# EAGLE design MiniBee (EAGLE 5.05)
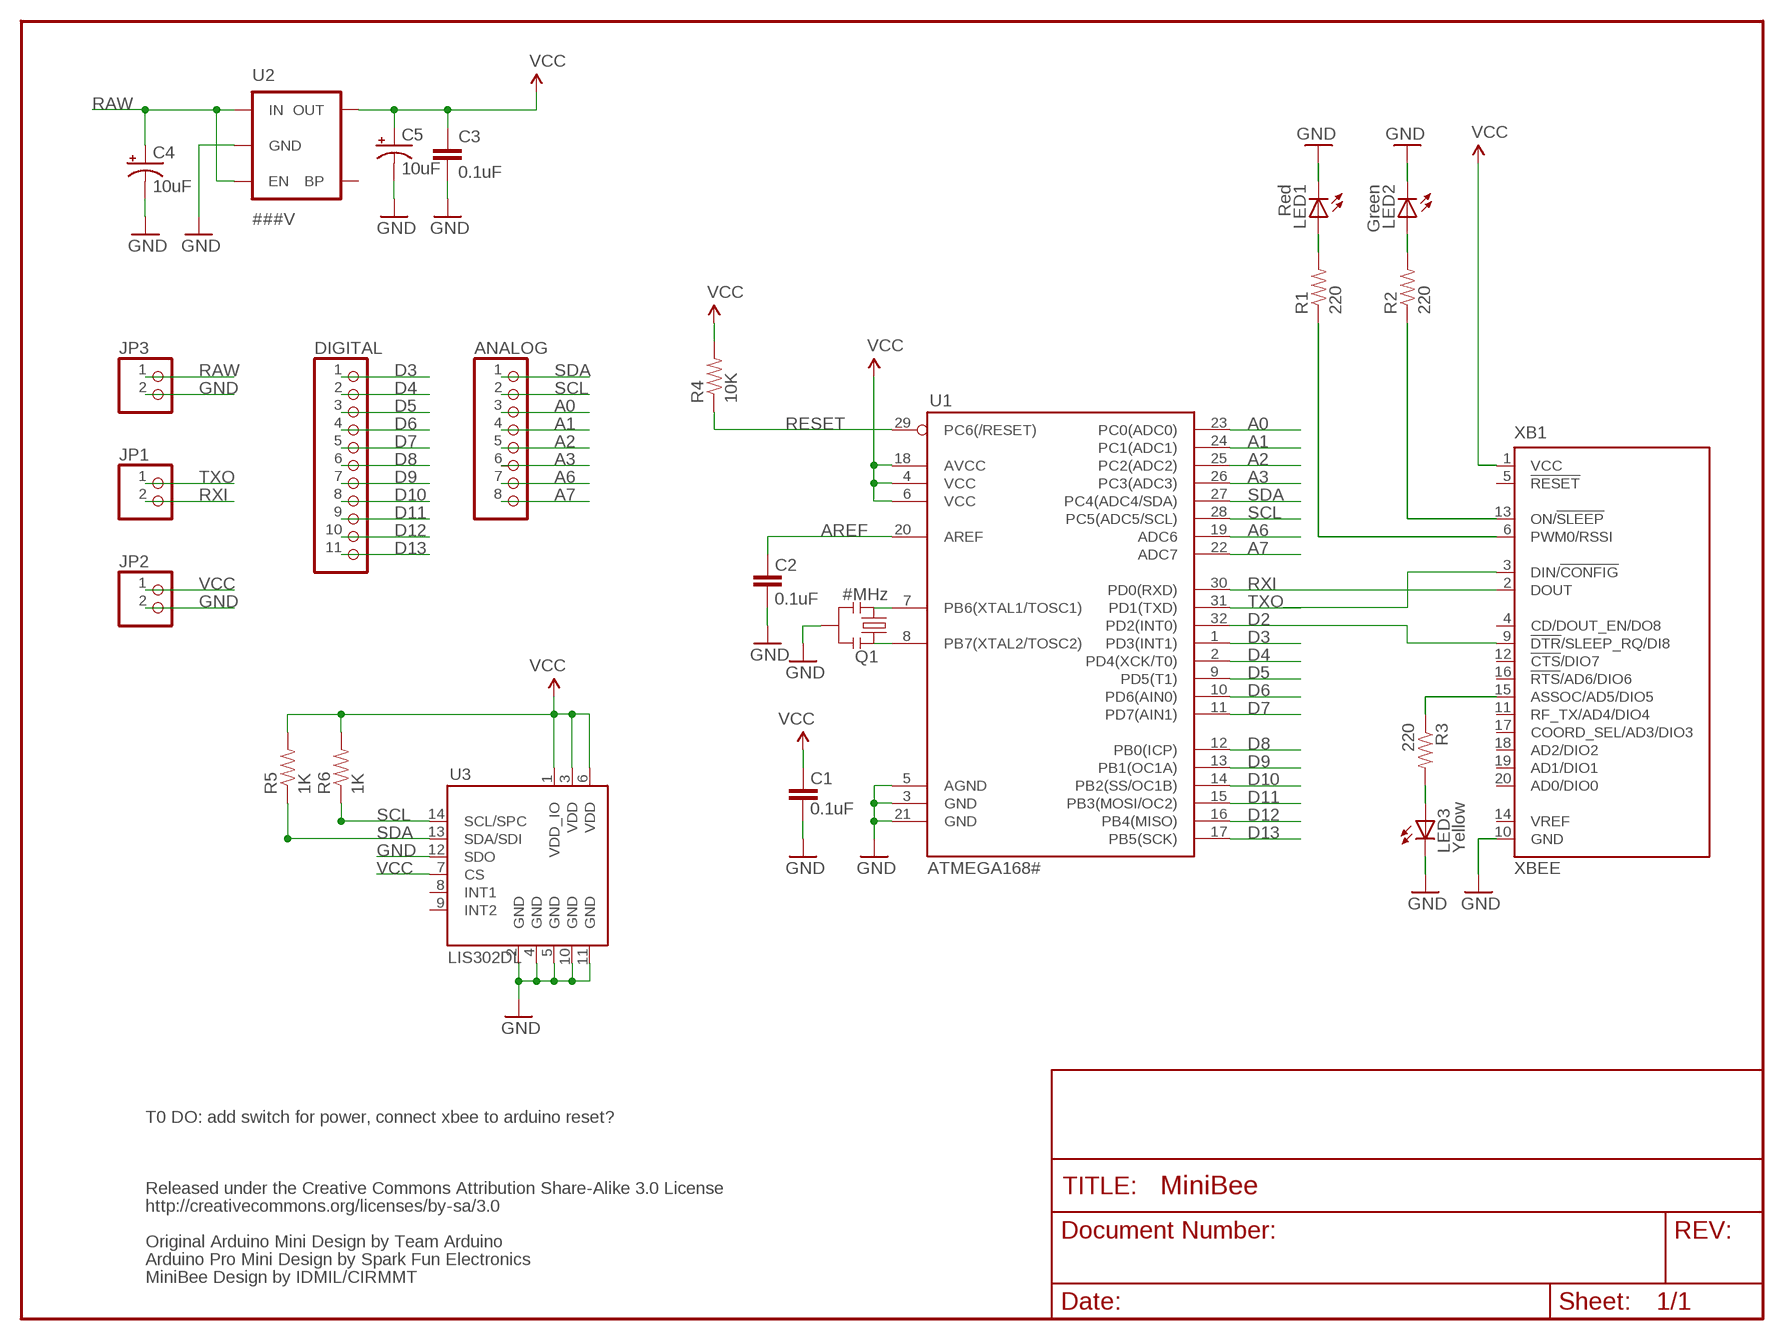
[diagram p0: schematic, sheet 1]

## Parts
ANALOG  PINHD-1X8  [1X08]
C1  0.1uF  CAP0402  [C0402]
C2  0.1uF  CAP0402  [C0402]
C3  0.1uF  CAP0402  [C0402]
C4  10uF  CAP_POL1206  [EIA3216]
C5  10uF  CAP_POL1206  [EIA3216]
DIGITAL  PINHD-1X11  [1X11]
JP1  PINHD-1X2  [1X02]
JP2  PINHD-1X2  [1X02]
JP3  PINHD-1X2  [1X02]
LED1  Red  LED0603  [LED-0603]
LED2  Green  LED0603  [LED-0603]
LED3  Yellow  LED0603  [LED-0603]
Q1  #MHz  RESONATORSMD  [RESONATOR-SMD]
R1  220  RESISTOR0402  [C0402]
R2  220  RESISTOR0402  [C0402]
R3  220  RESISTOR0402  [C0402]
R4  10K  RESISTOR0402  [C0402]
R5  1K  RESISTOR0402  [C0402]
R6  1K  RESISTOR0402  [C0402]
U1  ATMEGA168#  ATMEGA168  [TQFP32-08]
U2  ###V  V_REG_LDOSMD  [SOT23-5]
U3  LIS302DL  [LGA14]
XB1  XBEE  [XBEE]

## Nets
A0: ANALOG.3 U1.23(PC0(ADC0))
A1: ANALOG.4 U1.24(PC1(ADC1))
A2: ANALOG.5 U1.25(PC2(ADC2))
A3: ANALOG.6 U1.26(PC3(ADC3))
A6: ANALOG.7 U1.19(ADC6)
A7: ANALOG.8 U1.22(ADC7)
AREF: C2.2 U1.20(AREF)
D2: U1.32(PD2(INT0)) XB1.9(!DTR!/SLEEP_RQ/DI8)
D3: DIGITAL.1 U1.1(PD3(INT1))
D4: DIGITAL.2 U1.2(PD4(XCK/T0))
D5: DIGITAL.3 U1.9(PD5(T1))
D6: DIGITAL.4 U1.10(PD6(AIN0))
D7: DIGITAL.5 U1.11(PD7(AIN1))
D8: DIGITAL.6 U1.12(PB0(ICP))
D9: DIGITAL.7 U1.13(PB1(OC1A))
D10: DIGITAL.8 U1.14(PB2(SS/OC1B))
D11: DIGITAL.9 U1.15(PB3(MOSI/OC2))
D12: DIGITAL.10 U1.16(PB4(MISO))
D13: DIGITAL.11 U1.17(PB5(SCK))
GND [vcc]: C1.1 C2.1 C3.2 C4.C(-) C5.C(-) JP2.2 JP3.2 LED1.C LED2.C LED3.C Q1.2 U1.3(GND) U1.5(AGND) U1.21(GND) U2.2(GND) U3.2(GND) U3.4(GND) U3.5(GND) U3.10(GND) U3.11(GND) U3.12(SDO) XB1.10(GND)
N$1: Q1.1 U1.8(PB7(XTAL2/TOSC2))
N$2: Q1.3 U1.7(PB6(XTAL1/TOSC1))
N$3: LED3.A R3.2
N$4: R3.1 XB1.15(ASSOC/AD5/DIO5)
N$8: R2.1 XB1.13(ON/!SLEEP)
N$9: R1.1 XB1.6(PWM0/RSSI)
N$10: LED2.A R2.2
N$11: LED1.A R1.2
RAW [vcc]: C4.A(+) JP3.1 U2.1(IN) U2.3(EN)
RESET: R4.1 U1.29(PC6(/RESET))
RXI: JP1.2 U1.30(PD0(RXD)) XB1.2(DOUT)
SCL: ANALOG.2 R6.1 U1.28(PC5(ADC5/SCL)) U3.14(SCL/SPC)
SDA: ANALOG.1 R5.1 U1.27(PC4(ADC4/SDA)) U3.13(SDA/SDI)
TXO: JP1.1 U1.31(PD1(TXD)) XB1.3(DIN/!CONFIG)
VCC: C1.2 C3.1 C5.A(+) JP2.1 R4.2 R5.2 R6.2 U1.4(VCC) U1.6(VCC) U1.18(AVCC) U2.5(OUT) U3.1(VDD_IO) U3.3(VDD) U3.6(VDD) U3.7(CS) XB1.1(VCC)
Unconnected: U2.4(BP) U3.8(INT1) U3.9(INT2) XB1.4(CD/DOUT_EN/DO8) XB1.5(!RESET) XB1.11(RF_TX/AD4/DIO4) XB1.12(!CTS!/DIO7) XB1.14(VREF) XB1.16(!RTS!/AD6/DIO6) XB1.17(COORD_SEL/AD3/DIO3) XB1.18(AD2/DIO2) XB1.19(AD1/DIO1) XB1.20(AD0/DIO0)

## Notes on the sheet
- T0 DO: add switch for power, connect xbee to arduino reset?
- Released under the Creative Commons Attribution Share-Alike 3.0 License
- http://creativecommons.org/licenses/by-sa/3.0
- Original Arduino Mini Design by Team Arduino
- Arduino Pro Mini Design by Spark Fun Electronics
- MiniBee Design by IDMIL/CIRMMT

## Library data of the parts
ANALOG = pinhead:PINHD-1X8: PIN HEADER
C1-C3 = SparkFun:CAP: Capacitor Standard 0603 ceramic capacitor, and 0.1" leaded capacitor.
C4 C5 = SparkFun:CAP_POL: Capacitor Polarized These are standard SMD and PTH capacitors. Normally 10uF, 47uF, and 100uF in electrolytic and tantalum varieties. Always verify the external diameter of the through hole cap, it varies with capacity, voltage, and manufacturer. The EIA devices should be standard.
DIGITAL = pinhead:PINHD-1X11: PIN HEADER
JP1-JP3 = pinhead:PINHD-1X2: PIN HEADER
LED1-LED3 = SparkFun:LED: LEDs Standard schematic elements and footprints for 5mm, 3mm, 1206, and 0603 sized LEDs. 5mm - Spark Fun Electronics SKU : COM-00529 (and others)
Q1 = SparkFun:RESONATOR: Resonator Small SMD resonator. This is the itty bitty 10/20MHz resonators with built in caps. CSTCE10M0G55 and CSTCE20M0V53. Footprint has been reviewed closely but hasn't been tested yet.
R1-R6 = SparkFun:RESISTOR: Resistor Basic schematic elements and footprints for 0603, 1206, and PTH 1/10th watt (small) resistors.
U1 = SparkFun:ATMEGA168
U2 = SparkFun:V_REG_LDO: Voltage Regulator LDO Standard 150mA LDO voltage regulator in SOT-23 layout. Micrel part MIC5205. BP (by-pass) pin is used to lower output noise with 470pF cap.
U3 = SparkFun:LIS302DL
XB1 = maxstream:XBEE: XBee (TM) /XBee-PRO(TM) OEM RF Modules Source: MaxStream, Inc. xbee_productmanual.pdf

## Net classes
0 default: width 0.203 mm
1 vcc: width 0.254 mm

## Board
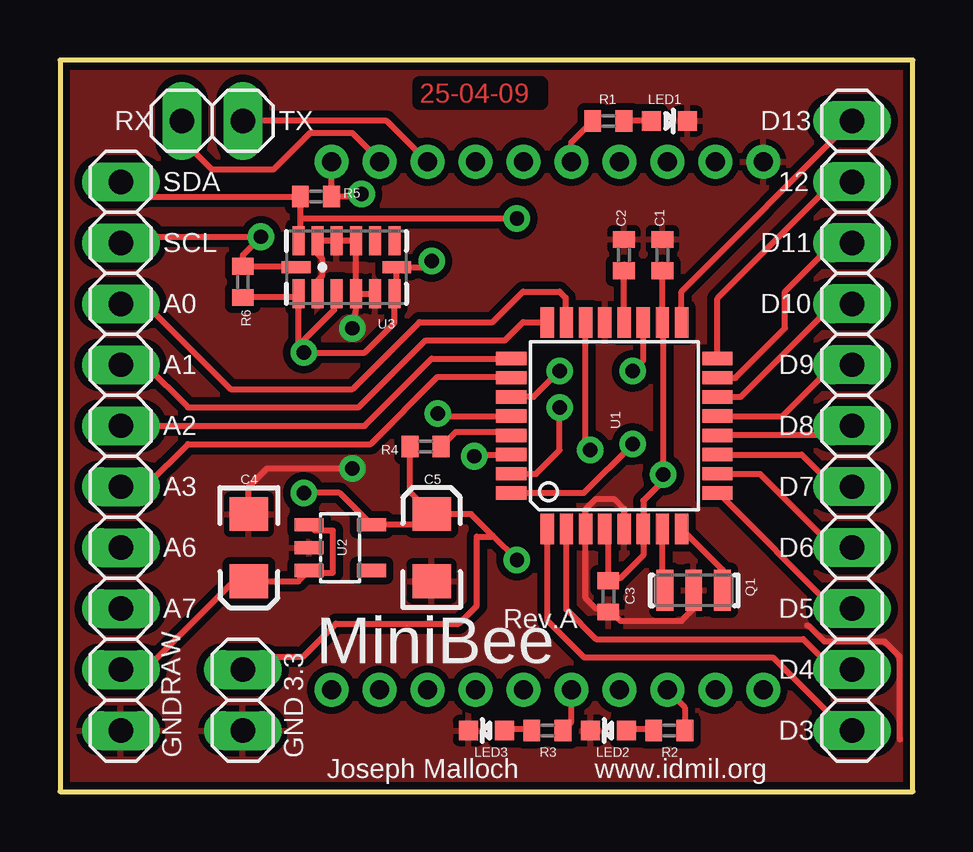
[diagram p1: board, top side]
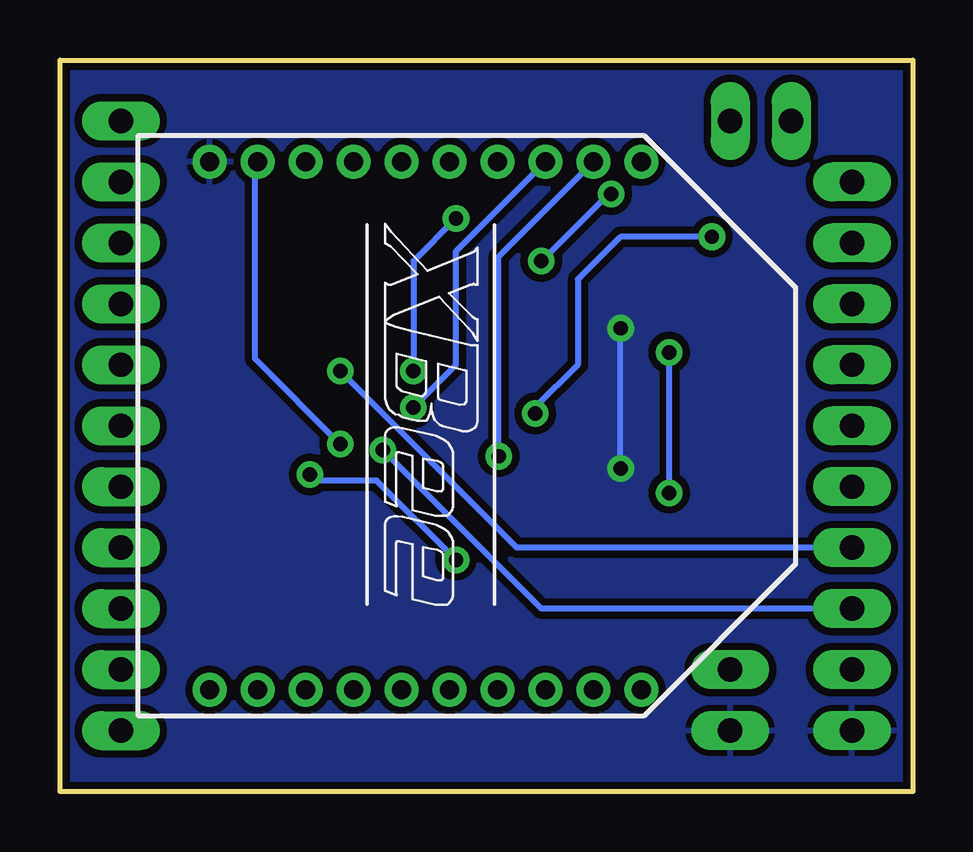
[diagram p2: board, bottom side, seen from below]

Size 35.56 x 30.48 mm. Coordinates in mm from the lower left corner, seen from the top.
Outline: 0,0 35.56,0 35.56,30.48 0,30.48 0,0
Copper layers (1*16): Top 0.035mm / dielectric 1.5mm / Bottom 0.035mm
Design rules "SparkFun *": minimum track width 10mil, minimum drill 20mil, track to track 10mil, track to pad 8mil, pad to pad 8mil, via to via 10mil, smd to smd 8mil, copper to edge 10mil, drill to drill 8mil, minimum pad ring 12mil, minimum via ring 10mil, stop-mask expansion 4mil, vias tented up to drill 20mil, thermal gap 10mil

### Footprints (pad centres in the part's own frame; a part is rotated, then mirrored left to right if it is on the bottom)
1X08 = drill 1.016 long: 1 -8.89,0; 2 -6.35,0; 3 -3.81,0; 4 -1.27,0; 5 1.27,0; 6 3.81,0; 7 6.35,0; 8 8.89,0
C0402 = smd 0.7 x 0.9: 1 -0.65,0; 2 0.65,0
EIA3216 = smd 1.4 x 1.6: A 1.4,0; C -1.4,0
1X11 = drill 1.016 long: 1 -12.7,0; 2 -10.16,0; 3 -7.62,0; 4 -5.08,0; 5 -2.54,0; 6 0,0; 7 2.54,0; 8 5.08,0; 9 7.62,0; 10 10.16,0; 11 12.7,0
1X02 = drill 1.016 long: 1 -1.27,0; 2 1.27,0
LED-0603 = smd 0.8 x 0.8: A 0,-0.75; C 0,0.75
RESONATOR-SMD = smd 0.7 x 1.7: 1 -1.2,0; 2 0,0; 3 1.2,0
TQFP32-08 = smd 1.27 x 0.559: 1 -4.293,2.8; 2 -4.293,2; 3 -4.293,1.2; 4 -4.293,0.4; 5 -4.293,-0.4; 6 -4.293,-1.2; 7 -4.293,-2; 8 -4.293,-2.8; 17 4.293,-2.8; 18 4.293,-2; 19 4.293,-1.2; 20 4.293,-0.4; 21 4.293,0.4; 22 4.293,1.2; 23 4.293,2; 24 4.293,2.8 | smd 0.559 x 1.27: 9 -2.8,-4.293; 10 -2,-4.293; 11 -1.2,-4.293; 12 -0.4,-4.293; 13 0.4,-4.293; 14 1.2,-4.293; 15 2,-4.293; 16 2.8,-4.293; 25 2.8,4.293; 26 2,4.293; 27 1.2,4.293; 28 0.4,4.293; 29 -0.4,4.293; 30 -1.2,4.293; 31 -2,4.293; 32 -2.8,4.293
SOT23-5 = smd 0.55 x 1.2: 1 -0.95,-1.3; 2 0,-1.3; 3 0.95,-1.3; 4 0.95,1.3; 5 -0.95,1.3
LGA14 = smd 0.5 x 1.2: 1 2,1.1; 2 1.2,1.1; 3 0.4,1.1; 4 -0.4,1.1; 5 -1.2,1.1; 6 -2,1.1; 8 -2,-1.1; 9 -1.2,-1.1; 10 -0.4,-1.1; 11 0.4,-1.1; 12 1.2,-1.1; 13 2,-1.1 | smd 1.2 x 0.5: 7 -2.1,0; 14 2.1,0
XBEE = drill 0.8 pad 1.27 round: 1 -11,9; 2 -11,7; 3 -11,5; 4 -11,3; 5 -11,1; 6 -11,-1; 7 -11,-3; 8 -11,-5; 9 -11,-7; 10 -11,-9; 11 11,-9; 12 11,-7; 13 11,-5; 14 11,-3; 15 11,-1; 16 11,1; 17 11,3; 18 11,5; 19 11,7; 20 11,9

### Placement (x,y rotation side)
ANALOG  2.54,16.51 270 top
C1  25.11,22.35 270 top
C2  23.51,22.35 270 top
C3  22.86,8.13 270 top
C4  7.87,10.16 270 top
C5  15.49,10.16 90 top
DIGITAL  33.02,15.24 90 top
JP1  6.35,27.94 180 top
JP2  7.62,3.81 270 top
JP3  2.54,3.81 270 top
LED1  25.4,27.94 270 top
LED2  22.86,2.54 90 top
LED3  17.78,2.54 90 top
Q1  26.42,8.38 180 top
R1  22.86,27.94 0 top
R2  25.4,2.54 180 top
R3  20.32,2.54 180 top
R4  15.24,14.38 180 top
R5  10.67,24.79 0 top
R6  7.62,21.23 270 top
U1  23.11,15.24 90 top
U2  11.68,10.16 270 top
U3  11.94,21.84 180 top
XB1  20.32,15.24 270 bottom

### Tracks (layer width: path | path; a pad name or v marks a point on that pad's centre or on a via)
A0
  Top 0.254: ANALOG.3 3.56,20.32 7.11,16.76 12.19,16.76 14.99,19.56 18.03,19.56 19.3,20.83 20.83,20.83 21.08,20.57 21.08,19.57 U1.23
A1
  Top 0.254: U1.24 20.29,19.56 19.3,19.56 18.54,18.8 15.24,18.8 12.45,16 5.33,16 3.56,17.78 ANALOG.4
A2
  Top 0.254: ANALOG.5 12.7,15.24 15.49,18.03 U1.25
A3
  Top 0.254: ANALOG.6 3.56,12.7 5.33,14.48 12.95,14.48 15.75,17.27 18.79,17.27 U1.26
A6  (via drill 0.6)
  Top 0.254: U1.19 24.31,17.96 v23.88,17.53
  Bottom 0.254: v23.88,17.53 16.51,10.16 ANALOG.7
A7  (via drill 0.6)
  Top 0.254: U1.22 21.91,14.41 v22.1,14.22
  Bottom 0.254: v22.1,14.22 15.49,7.62 ANALOG.8
AREF
  Top 0.254: U1.20 23.51,21.95 C2.2
D2  (via drill 0.6)
  Top 0.254: U1.32 21.84,12.44 v23.88,14.48
  Bottom 0.254: v23.88,14.48 27.43,18.03 27.43,26.13 XB1.9
D3
  Top 0.254: U1.1 20.31,7.12 21.84,5.59 29.72,5.59 32.51,2.79 32.77,2.79 DIGITAL.1
D4
  Top 0.254: U1.2 21.11,7.59 22.35,6.35 30.99,6.35 32.26,5.08 DIGITAL.2
D5
  Top 0.254: U1.9 27.44,12.44 32.26,7.62 DIGITAL.3
D6
  Top 0.254: U1.10 29.18,13.24 32.26,10.16 DIGITAL.4
D7
  Top 0.254: U1.11 30.92,14.04 32.26,12.7 DIGITAL.5
D8
  Top 0.254: U1.12 27.5,14.88 32.75,14.88 33,15.12 DIGITAL.6
D9
  Top 0.254: U1.13 30.12,15.64 32.26,17.78 DIGITAL.7
D10
  Top 0.254: U1.14 28.38,16.44 32.26,20.32 DIGITAL.8
D11
  Top 0.254: U1.15 28.16,17.24 30.23,19.3 30.23,20.83 32.26,22.86 DIGITAL.9
D12
  Top 0.254: U1.16 27.41,20.55 32.26,25.4 DIGITAL.10
D13
  Top 0.254: U1.17 25.91,20.83 DIGITAL.11
GND  (via drill 0.6)
  Top 0.254: U3.4 U3.5 | U3.4 U3.10 U3.11 U3.12 10.67,22.87 10.67,22.48 10.92,22.23 10.92,21.46 10.74,21.28 U3.2 | Q1.2 26.42,7.62 25.91,7.11 23.37,7.11 23,7.48 C3.2 22.72,7.62 22.35,7.62 21.91,8.06 U1.3 21.91,11.75 22.35,12.19 23.11,12.19 23.51,11.79 U1.5 | C4.C 7.87,12.7 8.64,13.46 v12.19,13.46 | v12.19,19.3 12.45,20.64 U3.4 | 31.15,6.92 31.25,6.88 31.88,6.25 34.38,6.25 35,5.62 35,2.25 35.03,2.17
  Bottom 0.254: v12.19,13.46 v12.19,19.3
  pour Top (isolate 0.305): 0,0 0,30.48 35.56,30.48 35.56,0
  pour Bottom (isolate 0.305): 0,0 0,30.48 35.56,30.48 35.56,0
N$1
  Top 0.254: Q1.1 27.62,9.24 U1.8
N$2
  Top 0.254: U1.7 25.11,8.48 Q1.3
N$3
  Top 0.254: LED3.A 18.62,2.62 19.62,2.62 R3.2
N$4
  Top 0.254: XB1.15 21.32,2.89 R3.1
N$8
  Top 0.254: R2.1 26.05,3.51 XB1.13
N$9
  Top 0.254: XB1.6 21.32,27.05 R1.1
N$10
  Top 0.254: LED2.A 23.62,2.62 24.62,2.62 R2.2
N$11
  Top 0.254: LED1.A R1.2
RAW
  Top 0.254: JP3.1 3.56,5.08 7.11,8.64 7.75,8.64 C4.A 9.93,8.76 U2.3 10.5,9.12 11.38,9.12 11.38,10.88 10.62,10.88 10.5,11 U2.1
RESET
  Top 0.254: R4.1 16.51,14.99 18.68,14.99 U1.29
RXI  (via drill 0.6)
  Top 0.254: XB1.2 13.32,26.3 12.19,27.43 10.41,27.43 8.89,25.91 6.35,25.91 5.08,27.18 JP1.2 | U1.30 17.34,14.04 v17.27,13.97
  Bottom 0.254: v17.27,13.97 17.27,22.29 XB1.2
SCL  (via drill 0.6)
  Top 0.254: U3.14 9.8,21.88 R6.1 7.62,22.35 v8.38,23.11 2.79,23.11 ANALOG.2 | U1.28 15.86,15.64 v15.75,15.75
  Bottom 0.254: v15.75,15.75 15.75,16 13.97,17.78 13.97,21.34 12.19,23.11 v8.38,23.11
SDA  (via drill 0.6)
  Top 0.254: 10.02,23.88 R5.1 3.15,24.79 ANALOG.1 | 10.02,23.88 10.02,23.02 U3.13 | U1.27 19.74,16.44 v20.83,17.53 | 10.02,23.88 v19.05,23.88
  Bottom 0.254: v20.83,17.53 20.83,22.1 v19.05,23.88
TXO  (via drill 0.6)
  Top 0.254: JP1.1 13.62,27.94 XB1.3 | U1.31 19.84,13.24 20.83,14.22 v20.83,16
  Bottom 0.254: v20.83,16 19.05,17.78 19.05,22.51 XB1.3
VCC  (via drill 0.6)
  Top 0.254: C1.2 25.11,21.95 U1.18 25.15,19.5 v25.15,13.21 25.15,12.95 24.31,12.12 U1.6 24.31,9.84 23.37,8.89 22.97,8.89 C3.1 22.86,10.8 U1.4 | C5.A 15.04,11.11 U2.5 11.65,12.45 v10.16,12.45 | XB1.1 R5.2 12.47,24.79 v12.57,24.89 | R6.2 9.78,20.58 U3.1 9.94,18.57 v10.16,18.29 | v15.49,22.1 15.24,21.84 U3.7 14.04,20.84 U3.6 13.94,19.53 12.7,18.29 v10.16,18.29 | R4.2 14.59,12.46 C5.A | C5.A 17.14,11.56 18.04,10.66 | 18.04,10.66 v19.05,9.65 | 11.43,20.64 U3.3 11.43,20.74 11.43,20.07 10.16,18.8 v10.16,18.29 | JP2.1 7.62,5.12 8.12,5.62 10.12,5.62 11.5,7 16.62,7 17.38,7.75 17.38,10.62 18,10.62 18.04,10.66
  Bottom 0.254: v12.57,24.89 12.7,24.89 v15.49,22.1 | v19.05,9.65 22.35,12.95 24.89,12.95 v25.15,13.21 | v10.16,12.45 v10.16,18.29

### Text on the board
Top: 25-04-09
tPlace: RX | TX | D13 | SDA | 12 | SCL | D11 | A0 | D10 | A1 | D9 | A2 | D8 | A3 | D7 | A6 | D6 | Rev.A | A7 | D5 | MiniBee | D4 | RAW | 3.3 | D3 | GND | GND | Joseph Malloch | www.idmil.org
tValues: Tent Vias! | Arduino Wee v1.3